# Altium schematic sheet 辉光管驱动.SchDoc
size A4; SheetNumber: 3; SheetTotal: 3
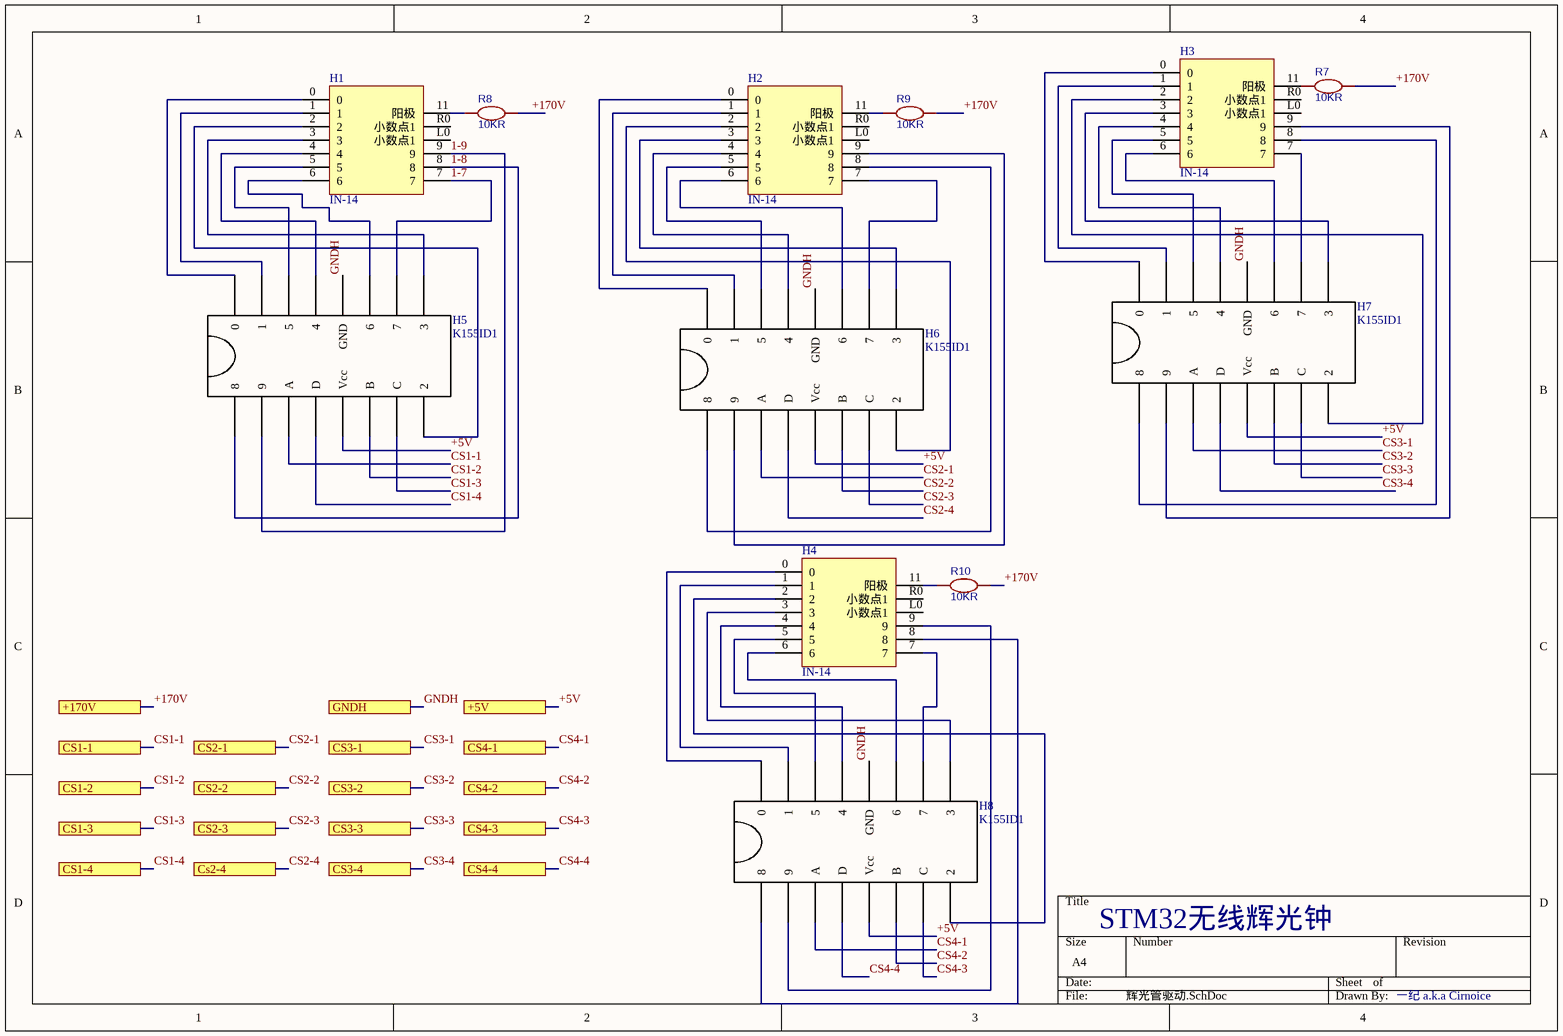
[diagram p0: 辉光管驱动.SchDoc]

## Parts
H1  IN-14  [IN-14]
H2  IN-14  [IN-14]
H3  IN-14  [IN-14]
H4  IN-14  [IN-14]
H5  K155ID1  [DIP-16]
H6  K155ID1  [DIP-16]
H7  K155ID1  [DIP-16]
H8  K155ID1  [DIP-16]
R7  10KR  [R0603]
R8  10KR  [R0603]
R9  10KR  [R0603]
R10  10KR  [R0603]

## Ports
+5V, +170V, CS1-1, CS1-2, CS1-3, CS1-4, CS2-1, CS2-2, CS2-3, Cs2-4, CS3-1, CS3-2, CS3-3, CS3-4, CS4-1, CS4-2, CS4-3, CS4-4, GNDH

## Nets
1-7: H1.7 H5.10(7)
1-8: H1.8 H5.1(8)
1-9: H1.9 H5.2(9)
+5V: H5.5(Vcc) H6.5(Vcc) H7.5(Vcc) H8.5(Vcc) ; port +5V
+170V: R7.2 R8.2 R9.2 R10.2 ; port +170V
CS1-1: H5.3(A) ; port CS1-1
CS1-2: H5.6(B) ; port CS1-2
CS1-3: H5.7(C) ; port CS1-3
CS1-4: H5.4(D) ; port CS1-4
CS2-1: H6.3(A) ; port CS2-1
CS2-2: H6.6(B) ; port CS2-2
CS2-3: H6.7(C) ; port CS2-3
CS2-4: H6.4(D) ; port Cs2-4
CS3-1: H7.3(A) ; port CS3-1
CS3-2: H7.6(B) ; port CS3-2
CS3-3: H7.7(C) ; port CS3-3
CS3-4: H7.4(D) ; port CS3-4
CS4-1: H8.3(A) ; port CS4-1
CS4-2: H8.6(B) ; port CS4-2
CS4-3: H8.7(C) ; port CS4-3
CS4-4: H8.4(D) ; port CS4-4
GNDH: H5.12(GND) H6.12(GND) H7.12(GND) H8.12(GND) ; port GNDH
NetH1_0: H1.0 H5.16(0)
NetH1_1: H1.1 H5.15(1)
NetH1_2: H1.2 H5.8(2)
NetH1_3: H1.3 H5.9(3)
NetH1_4: H1.4 H5.13(4)
NetH1_5: H1.5 H5.14(5)
NetH1_6: H1.6 H5.11(6)
NetH1_11: H1.11(阳极) R8.1
NetH2_0: H2.0 H6.16(0)
NetH2_1: H2.1 H6.15(1)
NetH2_2: H2.2 H6.8(2)
NetH2_3: H2.3 H6.9(3)
NetH2_4: H2.4 H6.13(4)
NetH2_5: H2.5 H6.14(5)
NetH2_6: H2.6 H6.11(6)
NetH2_7: H2.7 H6.10(7)
NetH2_8: H2.8 H6.1(8)
NetH2_9: H2.9 H6.2(9)
NetH2_11: H2.11(阳极) R9.1
NetH3_0: H3.0 H7.16(0)
NetH3_1: H3.1 H7.15(1)
NetH3_2: H3.2 H7.8(2)
NetH3_3: H3.3 H7.9(3)
NetH3_4: H3.4 H7.13(4)
NetH3_5: H3.5 H7.14(5)
NetH3_6: H3.6 H7.11(6)
NetH3_7: H3.7 H7.10(7)
NetH3_8: H3.8 H7.1(8)
NetH3_9: H3.9 H7.2(9)
NetH3_11: H3.11(阳极) R7.1
NetH4_0: H4.0 H8.16(0)
NetH4_1: H4.1 H8.15(1)
NetH4_2: H4.2 H8.8(2)
NetH4_3: H4.3 H8.9(3)
NetH4_4: H4.4 H8.13(4)
NetH4_5: H4.5 H8.14(5)
NetH4_6: H4.6 H8.11(6)
NetH4_7: H4.7 H8.10(7)
NetH4_8: H4.8 H8.1(8)
NetH4_9: H4.9 H8.2(9)
NetH4_11: H4.11(阳极) R10.1

Not connected (* = marked no-connect by the designer): H1 L0(小数点1) R0(小数点1); H2 L0(小数点1) R0(小数点1); H3 L0(小数点1) R0(小数点1); H4 L0(小数点1) R0(小数点1)

## Notes on the sheet
- STM32无线辉光钟
- 一纪 a.k.a Cirnoice

## Library data of the parts
R7-R10 = 0603R: nameAlias: Value(Ω); Contributor: LCEDA_Lib; spicePre: R; spiceSymbolName: R_0603_EU